# EAGLE schematic PCB-SE-C15 (EAGLE 6.4)

## Sheet 1 of 2
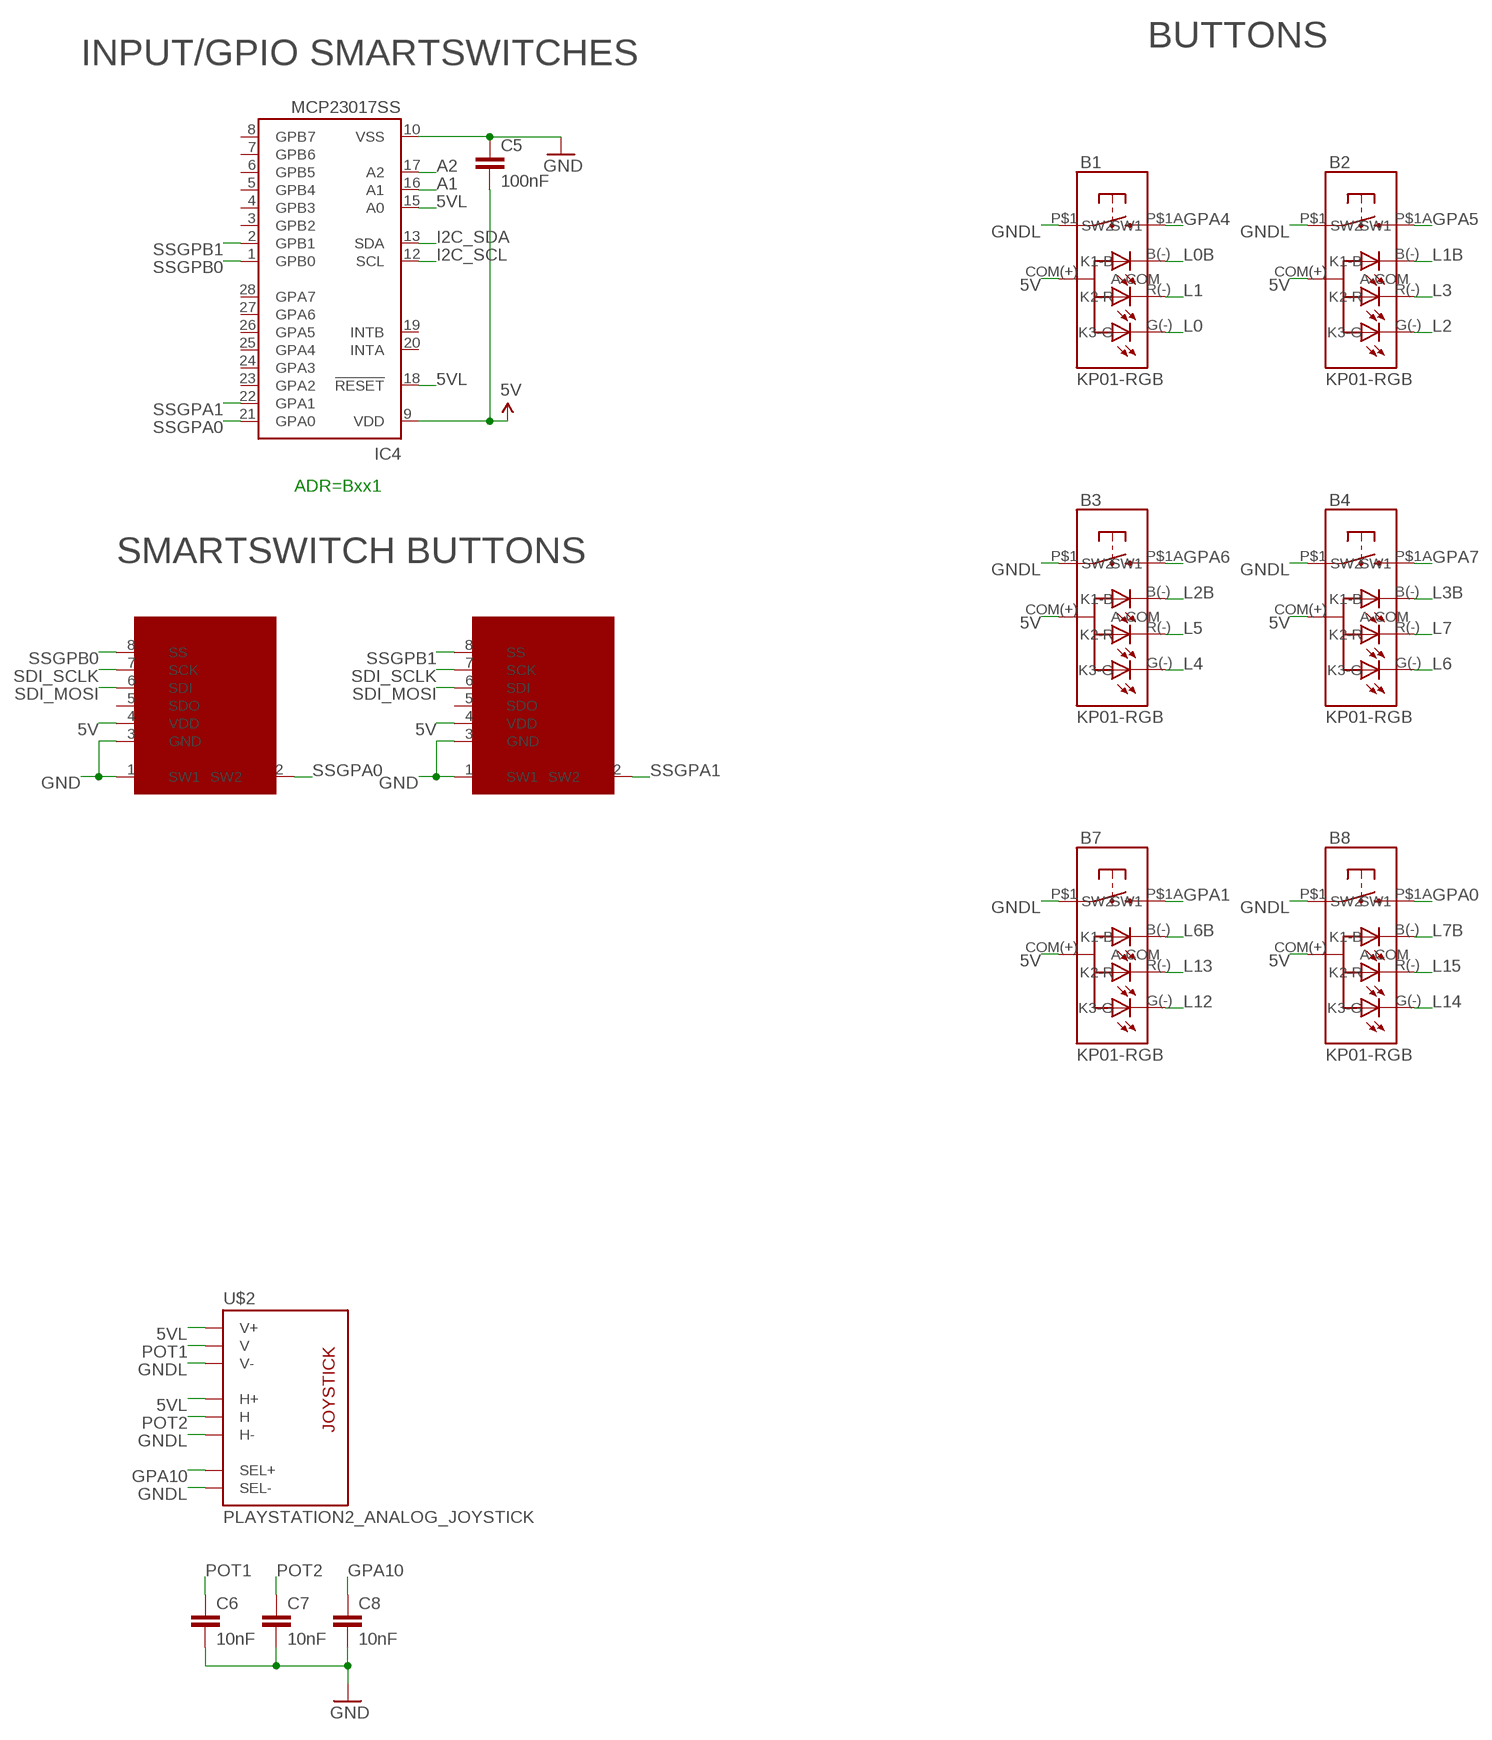
[diagram p0: schematic, sheet 1, part 1 of 2]
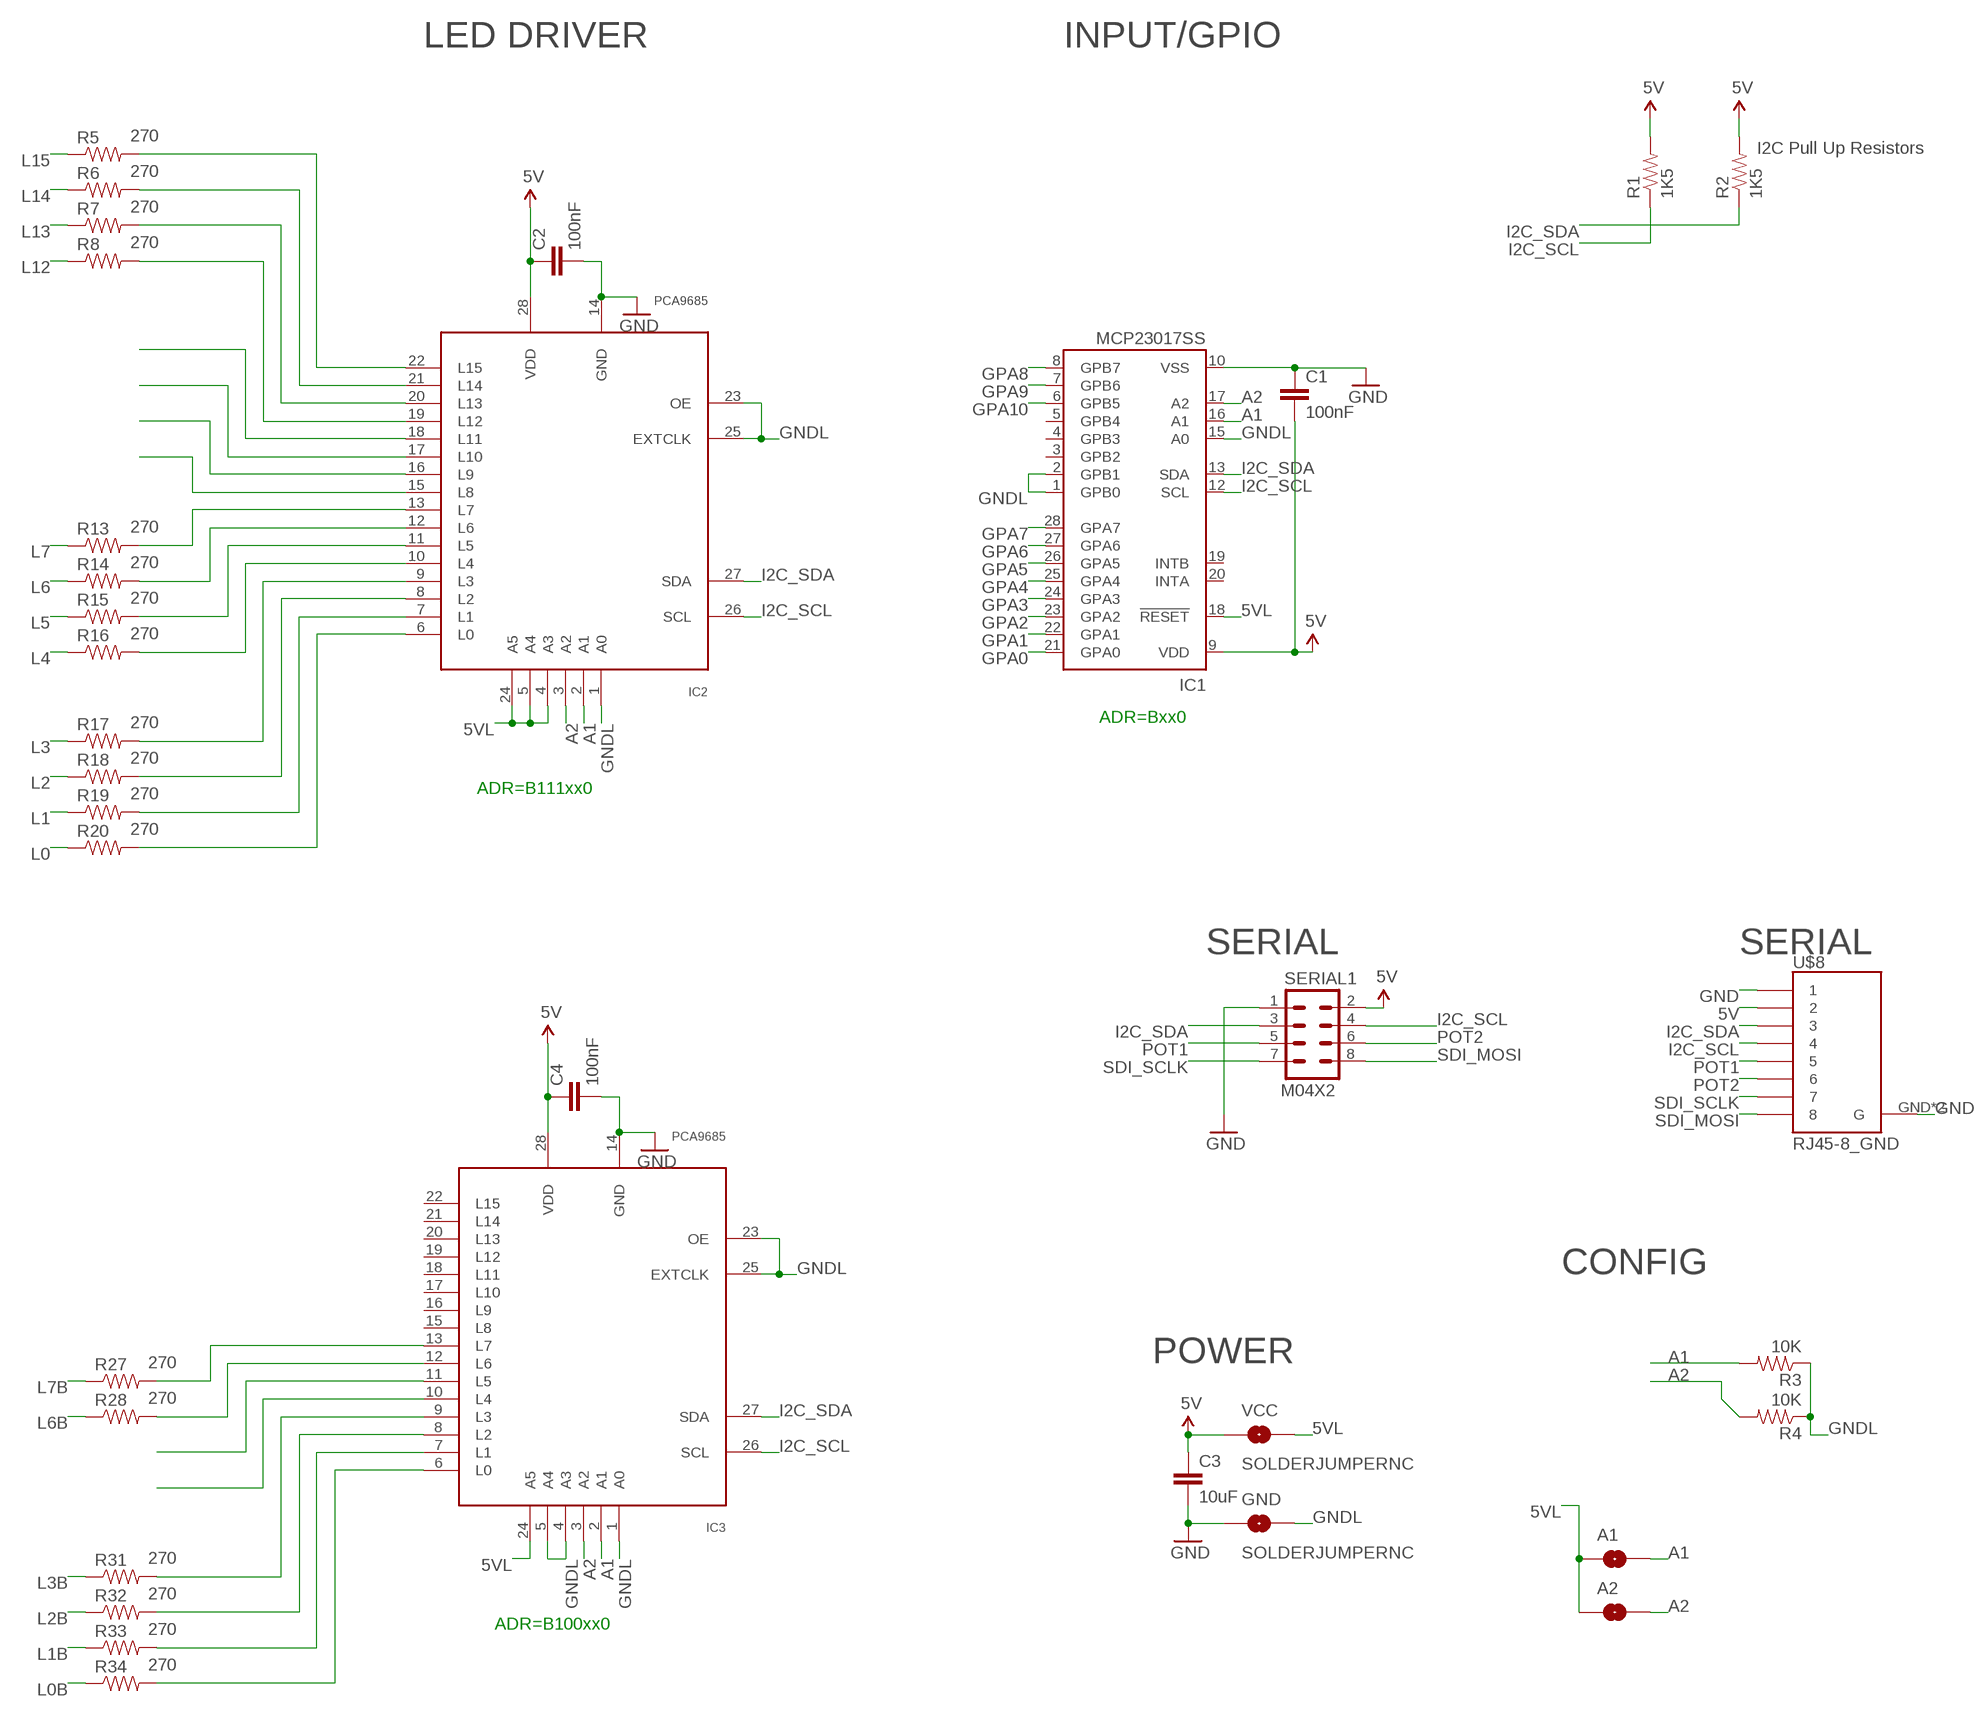
[diagram p1: schematic, sheet 1, part 2 of 2]

### Parts
A1  SOLDERJUMPERNC  [SJ_2S]
A2  SOLDERJUMPERNC  [SJ_2S]
B1  KP01-RGB  NKK-KP01  [NKK-KP01]
B2  KP01-RGB  NKK-KP01  [NKK-KP01]
B3  KP01-RGB  NKK-KP01  [NKK-KP01]
B4  KP01-RGB  NKK-KP01  [NKK-KP01]
B7  KP01-RGB  NKK-KP01  [NKK-KP01]
B8  KP01-RGB  NKK-KP01  [NKK-KP01]
C1  100nF  CAP0603-CAP  [0603-CAP]
C2  100nF  CAP0603-CAP  [0603-CAP]
C3  10uF  CAP0805  [0805]
C4  100nF  CAP0603-CAP  [0603-CAP]
C5  100nF  CAP0603-CAP  [0603-CAP]
C6  10nF  CAP0603-CAP  [0603-CAP]
C7  10nF  CAP0603-CAP  [0603-CAP]
C8  10nF  CAP0603-CAP  [0603-CAP]
GND  SOLDERJUMPERNC  [SJ_2S]
IC1  MCP23017SS  [SSOP28]
IC2  PCA9685  [TSSOP28]
IC3  PCA9685  [TSSOP28]
IC4  MCP23017SS  [SSOP28]
R1  1K5  RESISTOR0603-RES  [0603-RES]
R2  1K5  RESISTOR0603-RES  [0603-RES]
R3  10K  RESISTOR0603-RES  [0603-RES]
R4  10K  RESISTOR0603-RES  [0603-RES]
R5  270  RESISTOR0603-RES  [0603-RES]
R6  270  RESISTOR0603-RES  [0603-RES]
R7  270  RESISTOR0603-RES  [0603-RES]
R8  270  RESISTOR0603-RES  [0603-RES]
R13  270  RESISTOR0603-RES  [0603-RES]
R14  270  RESISTOR0603-RES  [0603-RES]
R15  270  RESISTOR0603-RES  [0603-RES]
R16  270  RESISTOR0603-RES  [0603-RES]
R17  270  RESISTOR0603-RES  [0603-RES]
R18  270  RESISTOR0603-RES  [0603-RES]
R19  270  RESISTOR0603-RES  [0603-RES]
R20  270  RESISTOR0603-RES  [0603-RES]
R27  270  RESISTOR0603-RES  [0603-RES]
R28  270  RESISTOR0603-RES  [0603-RES]
R31  270  RESISTOR0603-RES  [0603-RES]
R32  270  RESISTOR0603-RES  [0603-RES]
R33  270  RESISTOR0603-RES  [0603-RES]
R34  270  RESISTOR0603-RES  [0603-RES]
SERIAL1  M04X2  [2X4]
U$2  PLAYSTATION2_ANALOG_JOYSTICK  [PLAYSTATION2_ANALOG_JOYSTICK]
U$4  SMART_SWITCHSMART_SWITCH_8PIN  [SMART_SWITCH]
U$7  SMART_SWITCHSMART_SWITCH_8PIN  [SMART_SWITCH]
U$8  RJ45-8_GND  [RJ45-8_GND]
VCC  SOLDERJUMPERNC  [SJ_2S]

### Nets
5V [Power]: B1.COM(+)(A-COM) B2.COM(+)(A-COM) B3.COM(+)(A-COM) B4.COM(+)(A-COM) B7.COM(+)(A-COM) B8.COM(+)(A-COM) C1.2 C2.1 C3.1 C4.1 C5.2 IC1.9(VDD) IC2.28(VDD) IC3.28(VDD) IC4.9(VDD) R1.2 R2.2 SERIAL1.2 U$4.4(VDD) U$7.4(VDD) U$8.2 VCC.1
5VL: A1.1 A2.1 IC1.18(!RESET) IC2.4(A3) IC2.5(A4) IC2.24(A5) IC3.24(A5) IC4.15(A0) IC4.18(!RESET) U$2.H1(H+) U$2.V1(V+) VCC.2
A1: A1.2 IC1.16(A1) IC2.2(A1) IC3.2(A1) IC4.16(A1) R3.2
A2: A2.2 IC1.17(A2) IC2.3(A2) IC3.3(A2) IC4.17(A2) R4.2
GND [Power]: C1.1 C2.2 C3.2 C4.2 C5.1 C6.2 C7.2 C8.2 GND.1 IC1.10(VSS) IC2.14(GND) IC3.14(GND) IC4.10(VSS) SERIAL1.1 U$4.1(SW1) U$4.3(GND) U$7.1(SW1) U$7.3(GND) U$8.1 U$8.GND1(G) U$8.GND(G)
GNDL: B1.P$1(SW1) B2.P$1(SW1) B3.P$1(SW1) B4.P$1(SW1) B7.P$1(SW1) B8.P$1(SW1) GND.2 IC1.1(GPB0) IC1.2(GPB1) IC1.15(A0) IC2.1(A0) IC2.23(OE) IC2.25(EXTCLK) IC3.1(A0) IC3.4(A3) IC3.5(A4) IC3.23(OE) IC3.25(EXTCLK) R3.1 R4.1 U$2.B2A(SEL-) U$2.H3(H-) U$2.V3(V-)
GPA0: B8.P$1A(SW2) IC1.21(GPA0)
GPA1: B7.P$1A(SW2) IC1.22(GPA1)
GPA2: IC1.23(GPA2)
GPA3: IC1.24(GPA3)
GPA4: B1.P$1A(SW2) IC1.25(GPA4)
GPA5: B2.P$1A(SW2) IC1.26(GPA5)
GPA6: B3.P$1A(SW2) IC1.27(GPA6)
GPA7: B4.P$1A(SW2) IC1.28(GPA7)
GPA8: IC1.8(GPB7)
GPA9: IC1.7(GPB6)
GPA10: C8.1 IC1.6(GPB5) U$2.B1A(SEL+)
I2C_SCL: IC1.12(SCL) IC2.26(SCL) IC3.26(SCL) IC4.12(SCL) R1.1 SERIAL1.4 U$8.4
I2C_SDA: IC1.13(SDA) IC2.27(SDA) IC3.27(SDA) IC4.13(SDA) R2.1 SERIAL1.3 U$8.3
L0: B1.G(-)(K3-G) R20.1
L0B: B1.B(-)(K1-B) R34.1
L1: B1.R(-)(K2-R) R19.1
L1B: B2.B(-)(K1-B) R33.1
L2: B2.G(-)(K3-G) R18.1
L2B: B3.B(-)(K1-B) R32.1
L3: B2.R(-)(K2-R) R17.1
L3B: B4.B(-)(K1-B) R31.1
L4: B3.G(-)(K3-G) R16.1
L5: B3.R(-)(K2-R) R15.1
L6: B4.G(-)(K3-G) R14.1
L6B: B7.B(-)(K1-B) R28.1
L7: B4.R(-)(K2-R) R13.1
L7B: B8.B(-)(K1-B) R27.1
L12: B7.G(-)(K3-G) R8.1
L13: B7.R(-)(K2-R) R7.1
L14: B8.G(-)(K3-G) R6.1
L15: B8.R(-)(K2-R) R5.1
N$2: IC3.13(L7) R27.2
N$3: IC3.12(L6) R28.2
N$4: IC2.13(L7) R13.2
N$5: IC2.12(L6) R14.2
N$6: IC3.11(L5)
N$7: IC2.11(L5) R15.2
N$9: IC2.10(L4) R16.2
N$10: IC2.9(L3) R17.2
N$11: IC2.8(L2) R18.2
N$12: IC2.7(L1) R19.2
N$13: IC3.10(L4)
N$14: IC3.9(L3) R31.2
N$15: IC3.8(L2) R32.2
N$16: IC3.7(L1) R33.2
N$17: IC3.6(L0) R34.2
N$19: IC2.6(L0) R20.2
N$20: IC2.15(L8)
N$21: IC2.16(L9)
N$22: IC2.17(L10)
N$23: IC2.18(L11)
N$24: IC2.19(L12) R8.2
N$25: IC2.20(L13) R7.2
N$26: IC2.21(L14) R6.2
N$27: IC2.22(L15) R5.2
POT1: C6.1 SERIAL1.5 U$2.V2(V) U$8.5
POT2: C7.1 SERIAL1.6 U$2.H2(H) U$8.6
SDI_MOSI: SERIAL1.8 U$4.6(SDI) U$7.6(SDI) U$8.8
SDI_SCLK: SERIAL1.7 U$4.7(SCK) U$7.7(SCK) U$8.7
SSGPA0: IC4.21(GPA0) U$4.2(SW2)
SSGPA1: IC4.22(GPA1) U$7.2(SW2)
SSGPB0: IC4.1(GPB0) U$4.8(SS)
SSGPB1: IC4.2(GPB1) U$7.8(SS)
Unconnected: IC1.3(GPB2) IC1.4(GPB3) IC1.5(GPB4) IC1.19(INTB) IC1.20(INTA) IC3.15(L8) IC3.16(L9) IC3.17(L10) IC3.18(L11) IC3.19(L12) IC3.20(L13) IC3.21(L14) IC3.22(L15) IC4.3(GPB2) IC4.4(GPB3) IC4.5(GPB4) IC4.6(GPB5) IC4.7(GPB6) IC4.8(GPB7) IC4.19(INTB) IC4.20(INTA) IC4.23(GPA2) IC4.24(GPA3) IC4.25(GPA4) IC4.26(GPA5) IC4.27(GPA6) IC4.28(GPA7) U$4.5(SDO) U$7.5(SDO)

### Notes on the sheet
- LED DRIVER | INPUT/GPIO
- BUTTONS
- INPUT/GPIO SMARTSWITCHES
- I2C Pull Up Resistors
- ADR=Bxx1
- SMARTSWITCH BUTTONS
- ADR=Bxx0
- ADR=B111xx0
- SERIAL | SERIAL
- CONFIG
- POWER
- ADR=B100xx0

## Sheet 2 of 2

## Library data of the parts
A1 A2 GND VCC = SparkFun:SOLDERJUMPER: Solder Jumper Standard SMD solder jumper. Used to automate production. Two varients : Normally Open and Normally Closed are the same, but have different paste layers. NC will have a large amount of paste and should jumper during reflow.
B1-B4 B7 B8 = SKAARHOJ:NKK-KP01: NKK-KP01-15AC 100mA12VDC
C1-C8 = SparkFun:CAP: Capacitor Standard 0603 ceramic capacitor, and 0.1" leaded capacitor.
IC1 IC4 = microchip:MCP23017: http://ww1.microchip.com/downloads/en/DeviceDoc/21952a.pdf Source: http://ww1.microchip.com/downloads/en/DeviceDoc/21952a.pdf; MF: MICROCHIP; MPN: MCP23017-E/SS; OC_FARNELL: 1467674; OC_NEWARK: 31K2960
IC2 IC3 = wsmith:PCA9685
R1-R8 R13-R20 R27 R28 R31-R34 = SparkFun:RESISTOR: Resistor Basic schematic elements and footprints for 0603, 1206, and PTH resistors.
SERIAL1 = SparkFun:M04X2
U$2 = SKAARHOJ:PLAYSTATION2_ANALOG_JOYSTICK: Playstation2 Analog Joystick with a Switch
U$4 U$7 = SKAARHOJ:SMART_SWITCH: SMARTSWITCH IS15DSBFP4RGB www.nkksmartswitch.com
U$8 = SKAARHOJ:RJ45-8_GND

## Net classes
0 default: width 0.203 mm, drill 0.406 mm, clearance 0.203 mm
1 Power: width 0.406 mm, drill 0.61 mm, clearance 0.203 mm